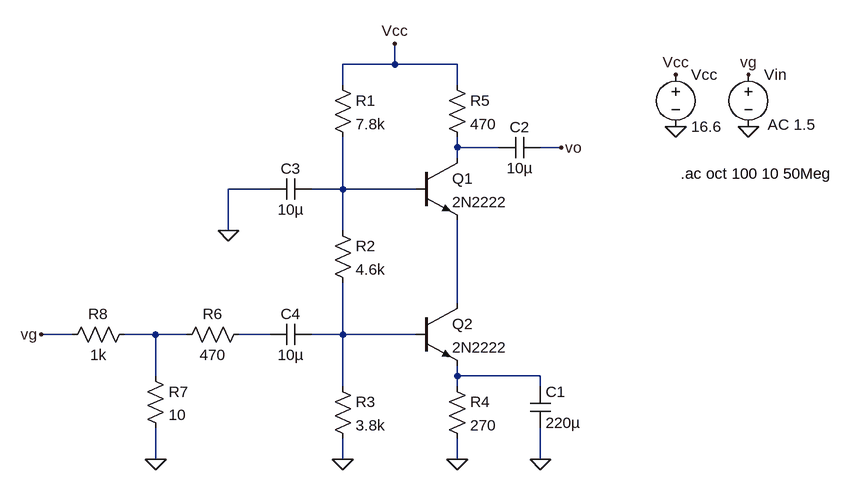
[diagram p0: schematic cascode-ce-high-freq.asc]
cascode-ce-high-freq.asc, the LTspice schematic file:
Version 4.1
SHEET 1 880 680
WIRE 160 -96 160 -128
WIRE 160 -96 80 -96
WIRE 256 -96 160 -96
WIRE 80 -64 80 -96
WIRE 256 -64 256 -96
WIRE 256 32 256 16
WIRE 320 32 256 32
WIRE 416 32 384 32
WIRE 256 48 256 32
WIRE -32 96 -96 96
WIRE 80 96 80 16
WIRE 80 96 32 96
WIRE 192 96 80 96
WIRE -96 160 -96 96
WIRE 80 160 80 96
WIRE 256 272 256 144
WIRE -336 320 -384 320
WIRE -208 320 -256 320
WIRE -160 320 -208 320
WIRE -32 320 -80 320
WIRE 80 320 80 240
WIRE 80 320 32 320
WIRE 192 320 80 320
WIRE -208 384 -208 320
WIRE 256 384 256 368
WIRE 384 384 256 384
WIRE 80 400 80 320
WIRE 256 400 256 384
WIRE 384 400 384 384
WIRE -208 512 -208 464
WIRE 80 512 80 480
WIRE 256 512 256 480
WIRE 384 512 384 464
FLAG 80 512 0
FLAG 256 512 0
FLAG -96 160 0
FLAG -208 512 0
FLAG 384 512 0
FLAG 704 -80 vg
FLAG 592 -80 Vcc
FLAG 592 0 0
FLAG 704 0 0
FLAG -384 320 vg
FLAG 160 -128 Vcc
FLAG 416 32 vo
SYMBOL npn 192 48 R0
SYMATTR InstName Q1
SYMATTR Value 2N2222
SYMBOL npn 192 272 R0
SYMATTR InstName Q2
SYMATTR Value 2N2222
SYMBOL res 64 -80 R0
SYMATTR InstName R1
SYMATTR Value 7.8k
SYMBOL res 64 144 R0
SYMATTR InstName R2
SYMATTR Value 4.6k
SYMBOL res 64 384 R0
SYMATTR InstName R3
SYMATTR Value 3.8k
SYMBOL res 240 384 R0
SYMATTR InstName R4
SYMATTR Value 270
SYMBOL res 240 -80 R0
SYMATTR InstName R5
SYMATTR Value 470
SYMBOL cap 368 400 R0
SYMATTR InstName C1
SYMATTR Value 220µ
SYMBOL cap 384 16 R90
WINDOW 0 0 32 VBottom 2
WINDOW 3 32 32 VTop 2
SYMATTR InstName C2
SYMATTR Value 10µ
SYMBOL cap 32 80 R90
WINDOW 0 0 32 VBottom 2
WINDOW 3 32 32 VTop 2
SYMATTR InstName C3
SYMATTR Value 10µ
SYMBOL cap 32 304 R90
WINDOW 0 0 32 VBottom 2
WINDOW 3 32 32 VTop 2
SYMATTR InstName C4
SYMATTR Value 10µ
SYMBOL res -64 304 R90
WINDOW 0 0 56 VBottom 2
WINDOW 3 32 56 VTop 2
SYMATTR InstName R6
SYMATTR Value 470
SYMBOL res -224 368 R0
SYMATTR InstName R7
SYMATTR Value 10
SYMBOL res -240 304 R90
WINDOW 0 0 56 VBottom 2
WINDOW 3 32 56 VTop 2
SYMATTR InstName R8
SYMATTR Value 1k
SYMBOL voltage 592 -96 R0
WINDOW 123 0 0 Left 0
WINDOW 39 0 0 Left 0
SYMATTR InstName Vcc
SYMATTR Value 16.6
SYMBOL voltage 704 -96 R0
WINDOW 123 30 93 Left 2
WINDOW 39 0 0 Left 0
SYMATTR Value2 AC 1.5
SYMATTR InstName Vin
SYMATTR Value ""
TEXT 600 72 Left 2 !.ac oct 100 10 50Meg

The netlist it stands for:
* cascode-ce-high-freq.asc
Q1 N001 N002 N003 0 2N2222
Q2 N003 N006 N007 0 2N2222
R1 Vcc N002 7.8k
R2 N002 N006 4.6k
R3 N006 0 3.8k
R4 N007 0 270
R5 Vcc N001 470
C1 N007 0 220µ
C2 vo N001 10µ
C3 N002 0 10µ
C4 N006 N005 10µ
R6 N005 N004 470
R7 N004 0 10
R8 N004 vg 1k
Vcc Vcc 0 16.6
Vin vg 0 AC 1.5
.model NPN NPN
.model PNP PNP
.lib standard.bjt
.ac oct 100 10 50Meg
.backanno
.end